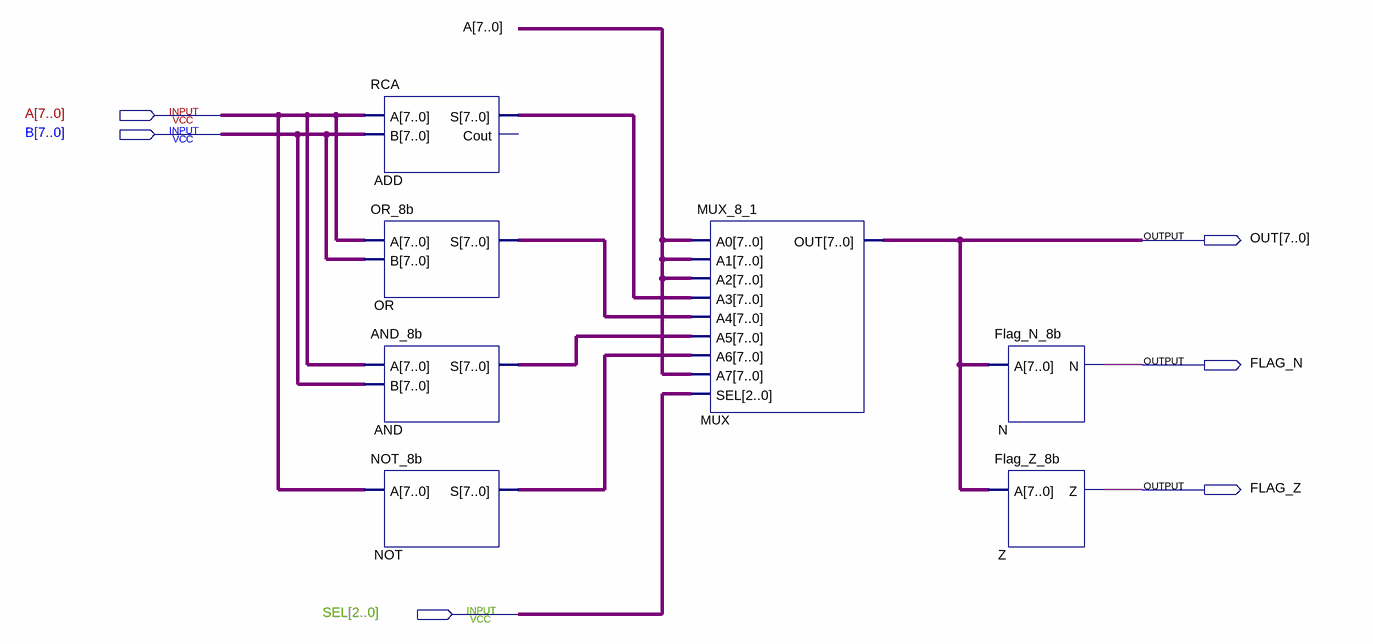
[diagram p0: schematic sheet]
// Quartus schematic ULA.bdf as structural Verilog: 7 symbols, 6 pins
module ULA (
  input  [7:0] A,
  input  [7:0] B,
  input  [2:0] SEL,
  output [7:0] OUT,
  output FLAG_N,
  output FLAG_Z
);

  wire [7:0] ADD_s, AND_s, NOT_s, OR_s;

  RCA ADD (.A(A), .B(B), .S(ADD_s));  // open: Cout
  OR_8b OR (.A(A), .B(B), .S(OR_s));
  AND_8b AND (.A(A), .B(B), .S(AND_s));
  NOT_8b NOT (.A(A), .S(NOT_s));
  MUX_8_1 MUX (.A0(A), .A1(A), .A2(A), .A3(ADD_s), .A4(OR_s), .A5(AND_s), .A6(NOT_s), .A7(A), .SEL(SEL), .OUT(OUT));
  Flag_N_8b N (.A(OUT), .N(FLAG_N));
  Flag_Z_8b Z (.A(OUT), .Z(FLAG_Z));
endmodule
